# EAGLE schematic LabFriendMain1 (EAGLE 7.7.0), part 2 of 2
## Sheet 12 of 13: Scope Input CH 0
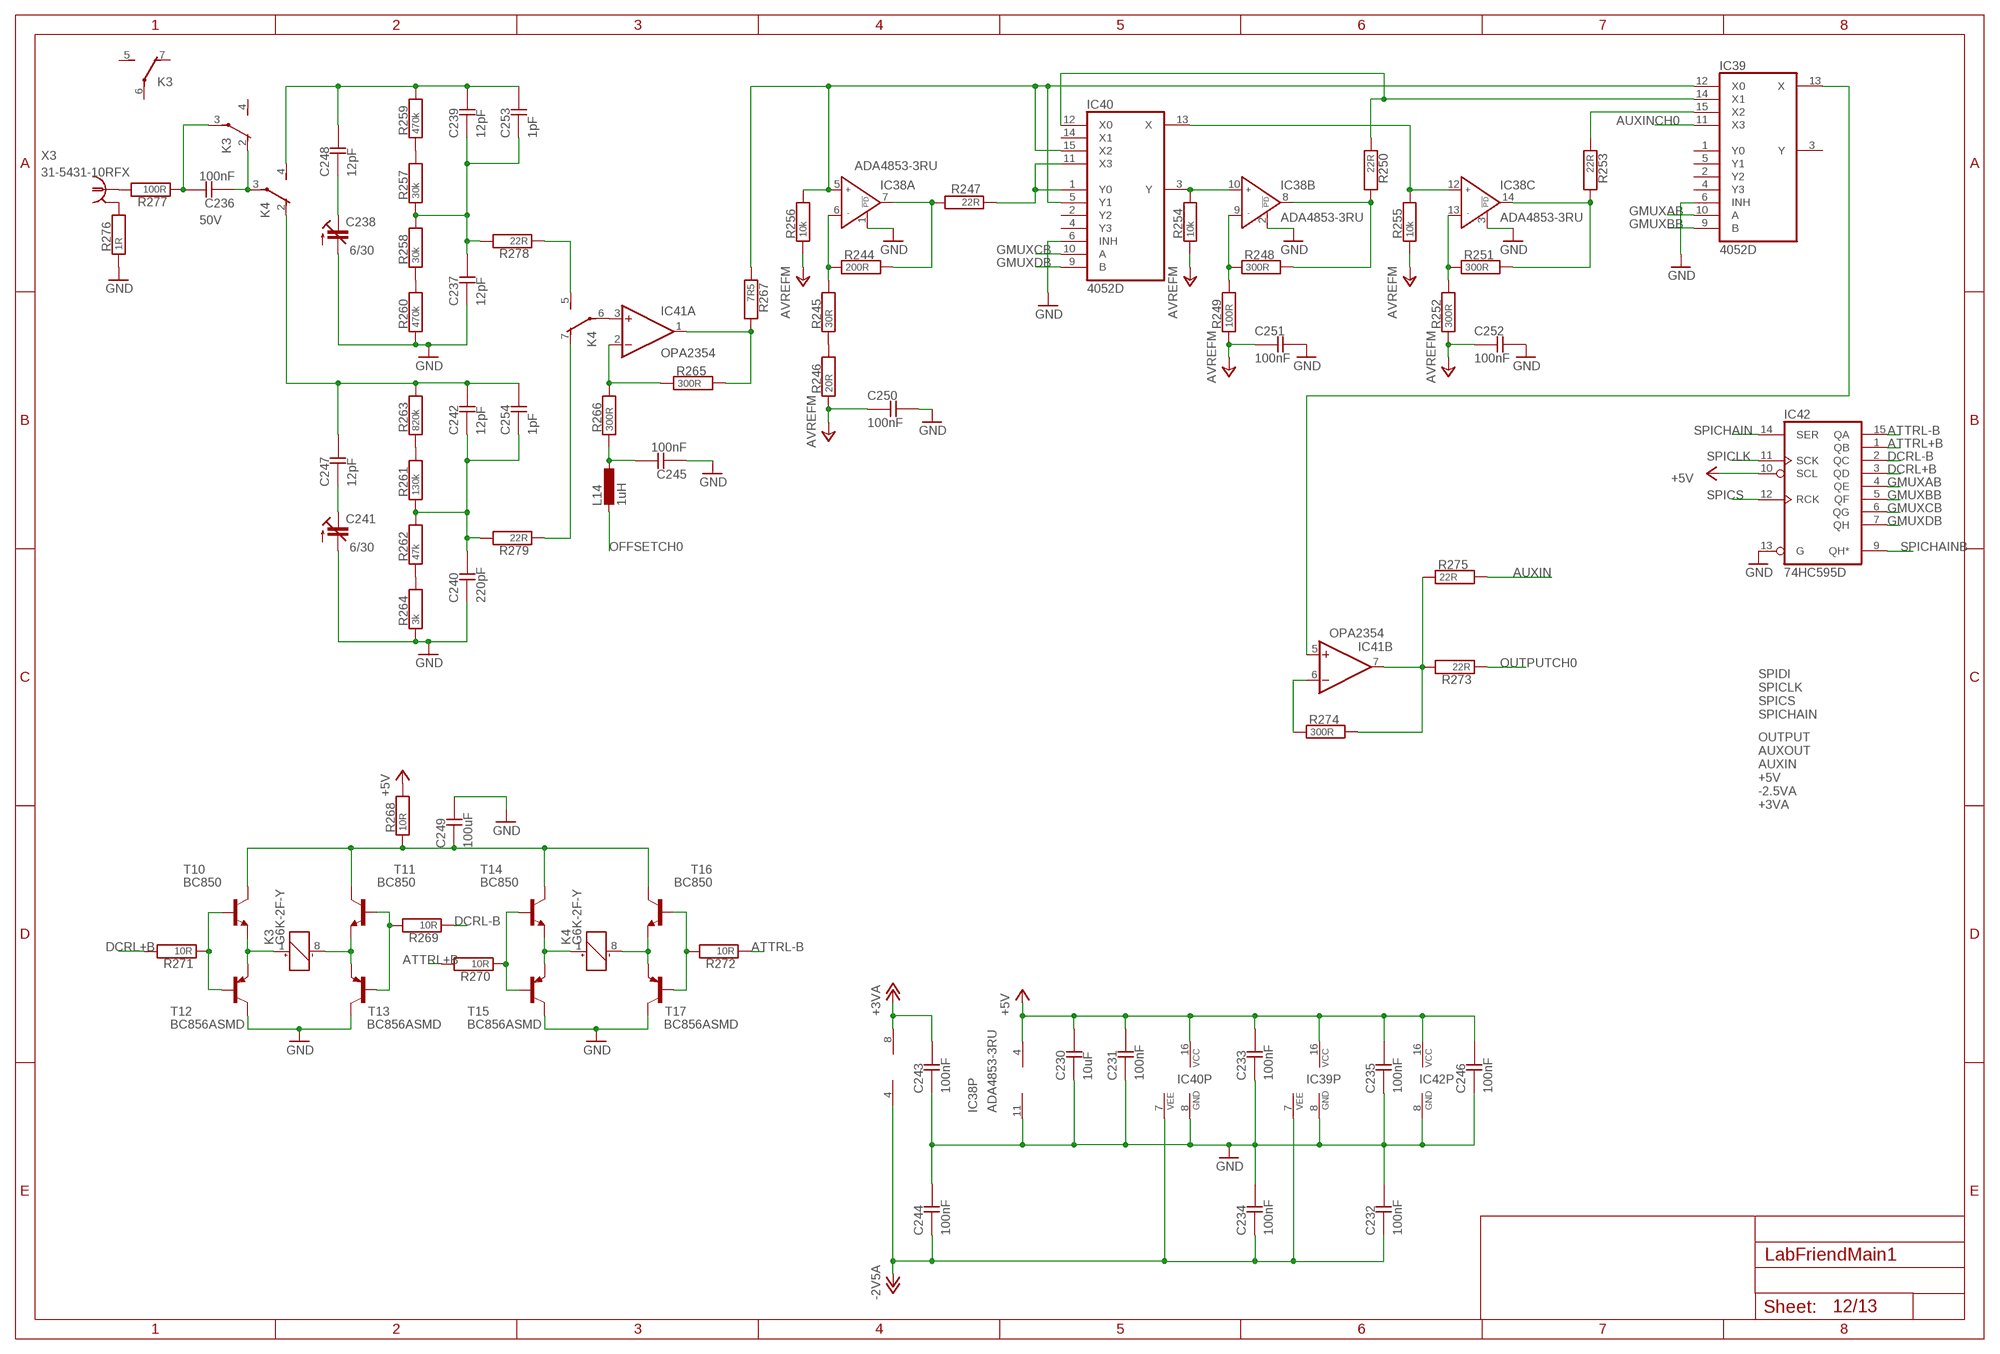
[diagram p11: schematic, sheet 12]

### Parts
C230  10uF  CAPC0603  [0603]
C231  100nF  CAPC0402  [0402]
C232  100nF  CAPC0402  [0402]
C233  100nF  CAPC0402  [0402]
C234  100nF  CAPC0402  [0402]
C235  100nF  CAPC0402  [0402]
C236  100nF  CAPC0603  [0603]
C237  12pF  CAPC0603  [0603]
C238  6/30  C-TRIMMTZBX4  [CTRIMTZBX4]
C239  12pF  CAPC0603  [0603]
C240  220pF  CAPC0603  [0603]
C241  6/30  C-TRIMMTZBX4  [CTRIMTZBX4]
C242  12pF  CAPC0603  [0603]
C243  100nF  CAPC0402  [0402]
C244  100nF  CAPC0402  [0402]
C245  100nF  CAPC0402  [0402]
C246  100nF  CAPC0402  [0402]
C247  12pF  CAPC0603  [0603]
C248  12pF  CAPC0603  [0603]
C249  100uF  CAPC1206  [1206]
C250  100nF  CAPC0402  [0402]
C251  100nF  CAPC0402  [0402]
C252  100nF  CAPC0402  [0402]
C253  1pF  CAPC0603  [0603]
C254  1pF  CAPC0603  [0603]
IC38  ADA4853-3RU  [SO14]
IC39  4052D  [SO16]
IC40  4052D  [SO16]
IC41  OPA2354  AD8682RM  [MSOP08]
IC42  74HC595D  [SO16]
K3  G6K-2F-Y  [G6K-2F-Y]
K4  G6K-2F-Y  [G6K-2F-Y]
L14  1uH  L-EUL3216C  [L3216C]
R244  200R  RESR0603  [0603]
R245  30R  RESR0603  [0603]
R246  20R  RESR0603  [0603]
R247  22R  RESR0603  [0603]
R248  300R  RESR0603  [0603]
R249  100R  RESR0603  [0603]
R250  22R  RESR0603  [0603]
R251  300R  RESR0603  [0603]
R252  300R  RESR0603  [0603]
R253  22R  RESR0603  [0603]
R254  10k  RESR0603  [0603]
R255  10k  RESR0603  [0603]
R256  10k  RESR0603  [0603]
R257  30k  RESR0603  [0603]
R258  30k  RESR0603  [0603]
R259  470k  RESR0603  [0603]
R260  470k  RESR0603  [0603]
R261  130k  RESR0603  [0603]
R262  47k  RESR0603  [0603]
R263  820k  RESR0603  [0603]
R264  3k  RESR0603  [0603]
R265  300R  RESR0603  [0603]
R266  300R  RESR0603  [0603]
R267  7R5  RESR0603  [0603]
R268  10R  RESR0603  [0603]
R269  10R  RESR0603  [0603]
R270  10R  RESR0603  [0603]
R271  10R  RESR0603  [0603]
R272  10R  RESR0603  [0603]
R273  22R  RESR0603  [0603]
R274  300R  RESR0603  [0603]
R275  22R  RESR0603  [0603]
R276  1R  RESR0603  [0603]
R277  100R  RESR0603  [0603]
R278  22R  RESR0603  [0603]
R279  22R  RESR0603  [0603]
T10  BC850  [SOT23]
T11  BC850  [SOT23]
T12  BC856ASMD  [SOT23-BEC]
T13  BC856ASMD  [SOT23-BEC]
T14  BC850  [SOT23]
T15  BC856ASMD  [SOT23-BEC]
T16  BC850  [SOT23]
T17  BC856ASMD  [SOT23-BEC]
X3  31-5431-10RFX  227161-8  [AMP_227161]

### Nets
3V3A: C243.2 IC41.8(P:V+) ; supply symbol labelled +3VA ; also sheet 3,6,7,11
+5V: C230.2 C231.2 C233.2 C235.2 C246.2 IC38.4(P:V+) IC39.16(VCC) IC40.16(VCC) IC42.10(SCL) IC42.16(VCC) R268.2 ; also sheet 6,7,8,9,11,13
-2V5A: C232.1 C234.1 C244.1 IC39.7(VEE) IC40.7(VEE) IC41.4(P:V-) ; also sheet 6,7,11
ATTRL+B: IC42.1(QB) R270.2
ATTRL-B: IC42.15(QA) R272.1
AUXIN: R275.2 ; also sheet 11
AUXINCH0: IC39.11(X3) ; also sheet 9
AVREFM: C250.1 C251.1 C252.1 R246.1 R249.1 R252.1 R254.1 R255.1 R256.1 ; also sheet 7,9,11
DCRL+B: IC42.3(QD) R271.2
DCRL-B: IC42.2(QC) R269.1
GMUXAB: IC39.10(A) IC42.4(QE)
GMUXBB: IC39.9(B) IC42.5(QF)
GMUXCB: IC40.10(A) IC42.6(QG)
GMUXDB: IC40.9(B) IC42.7(QH)
GND: C230.1 C231.1 C232.2 C233.1 C234.2 C235.1 C237.1 C238.2(A) C240.1 C241.2(A) C243.1 C244.2 C245.1 C246.1 C249.2 C250.2 C251.2 C252.2 IC38.1(A:!POWERDOWN) IC38.2(B:!POWERDOWN) IC38.3(C:!POWERDOWN) IC38.11(P:V-) IC39.6(INH) IC39.8(GND) IC40.6(INH) IC40.8(GND) IC42.8(GND) IC42.13(G) R260.1 R264.1 R276.1 T12.C T13.C T15.C T17.C ; also sheet 1,2,3,5,6,7,8,9,10,11,13
N$281: IC38.6(A:IN-) R244.1 R245.2
N$282: IC38.7(A:OUT) R244.2 R247.2
N$283: R245.1 R246.2
N$284: IC38.9(B:IN-) R248.1 R249.2
N$285: IC38.13(C:IN-) R251.1 R252.2
N$286: IC38.14(C:OUT) R251.2 R253.2
N$287: IC38.5(A:IN+) IC39.12(X0) IC40.5(Y1) IC40.15(X2) R256.2 R267.1
N$288: IC38.8(B:OUT) R248.2 R250.2
N$289: IC40.1(Y0) IC40.11(X3) R247.1
N$290: IC38.12(C:IN+) IC40.13(X) R255.2
N$291: IC39.14(X1) IC40.12(X0) R250.1
N$292: IC39.15(X2) R253.1
N$293: IC38.10(B:IN+) IC40.3(Y) R254.2
N$294: C236.2 K3.3(2:P) R277.1
N$295: C236.1 K3.2(2:O) K4.3(2:P)
N$296: R257.2 R259.1
N$297: C237.2 C239.1 C253.1 R257.1 R258.2 R278.2
N$298: R258.1 R260.2
N$299: C239.2 C248.2 C253.2 K4.4(2:S) R259.2
N$300: R261.2 R263.1
N$301: R262.1 R264.2
N$302: C242.2 C247.2 C254.2 K4.2(2:O) R263.2
N$303: IC41.2(A:-IN) R265.1 R266.2
N$304: IC41.1(A:OUT) R265.2 R267.2
N$305: IC39.13(X) IC41.5(B:+IN)
N$306: C249.1 R268.1 T10.3(C) T11.3(C) T14.3(C) T16.3(C)
N$307: K3.8(1:-) T11.2(E) T13.E
N$308: K3.1(1:+) T10.2(E) T12.E
N$309: R271.1 T10.1(B) T12.B
N$310: R269.2 T11.1(B) T13.B
N$311: K4.1(1:+) T14.2(E) T15.E
N$312: K4.8(1:-) T16.2(E) T17.E
N$313: R270.1 T14.1(B) T15.B
N$314: R272.2 T16.1(B) T17.B
N$315: IC41.7(B:OUT) R273.2 R274.2 R275.1
N$316: IC41.3(A:+IN) K4.6(3:P)
N$317: C241.1(E) C247.1
N$318: C238.1(E) C248.1
N$319: IC41.6(B:-IN) R274.1
N$320: C245.2 L14.1 R266.1
N$321: C240.2 C242.1 C254.1 R261.1 R262.2 R279.2
N$322: R276.2 X3.2
N$323: R277.2 X3.1
N$324: K4.5(3:S) R278.1
N$325: K4.7(3:O) R279.1
OFFSETCH0: L14.2 ; also sheet 7
OUTPUTCH0: R273.1 ; also sheet 3
SPICHAIN: IC42.14(SER) ; also sheet 11
SPICHAINB: IC42.9(QH*)
SPICLK: IC42.11(SCK) ; also sheet 1,11
SPICS: IC42.12(RCK) ; also sheet 1,11
Unconnected: IC39.1(Y0) IC39.2(Y2) IC39.3(Y) IC39.4(Y3) IC39.5(Y1) IC40.2(Y2) IC40.4(Y3) IC40.14(X1) K3.4(2:S) K3.5(3:S) K3.6(3:P) K3.7(3:O)

### Notes on the sheet
- SPIDI
  SPICLK
  SPICS
  SPICHAIN
- OUTPUT
  AUXOUT
  AUXIN
  +5V
  -2.5VA
  +3VA

## Sheet 13 of 13: High Frequency DAC
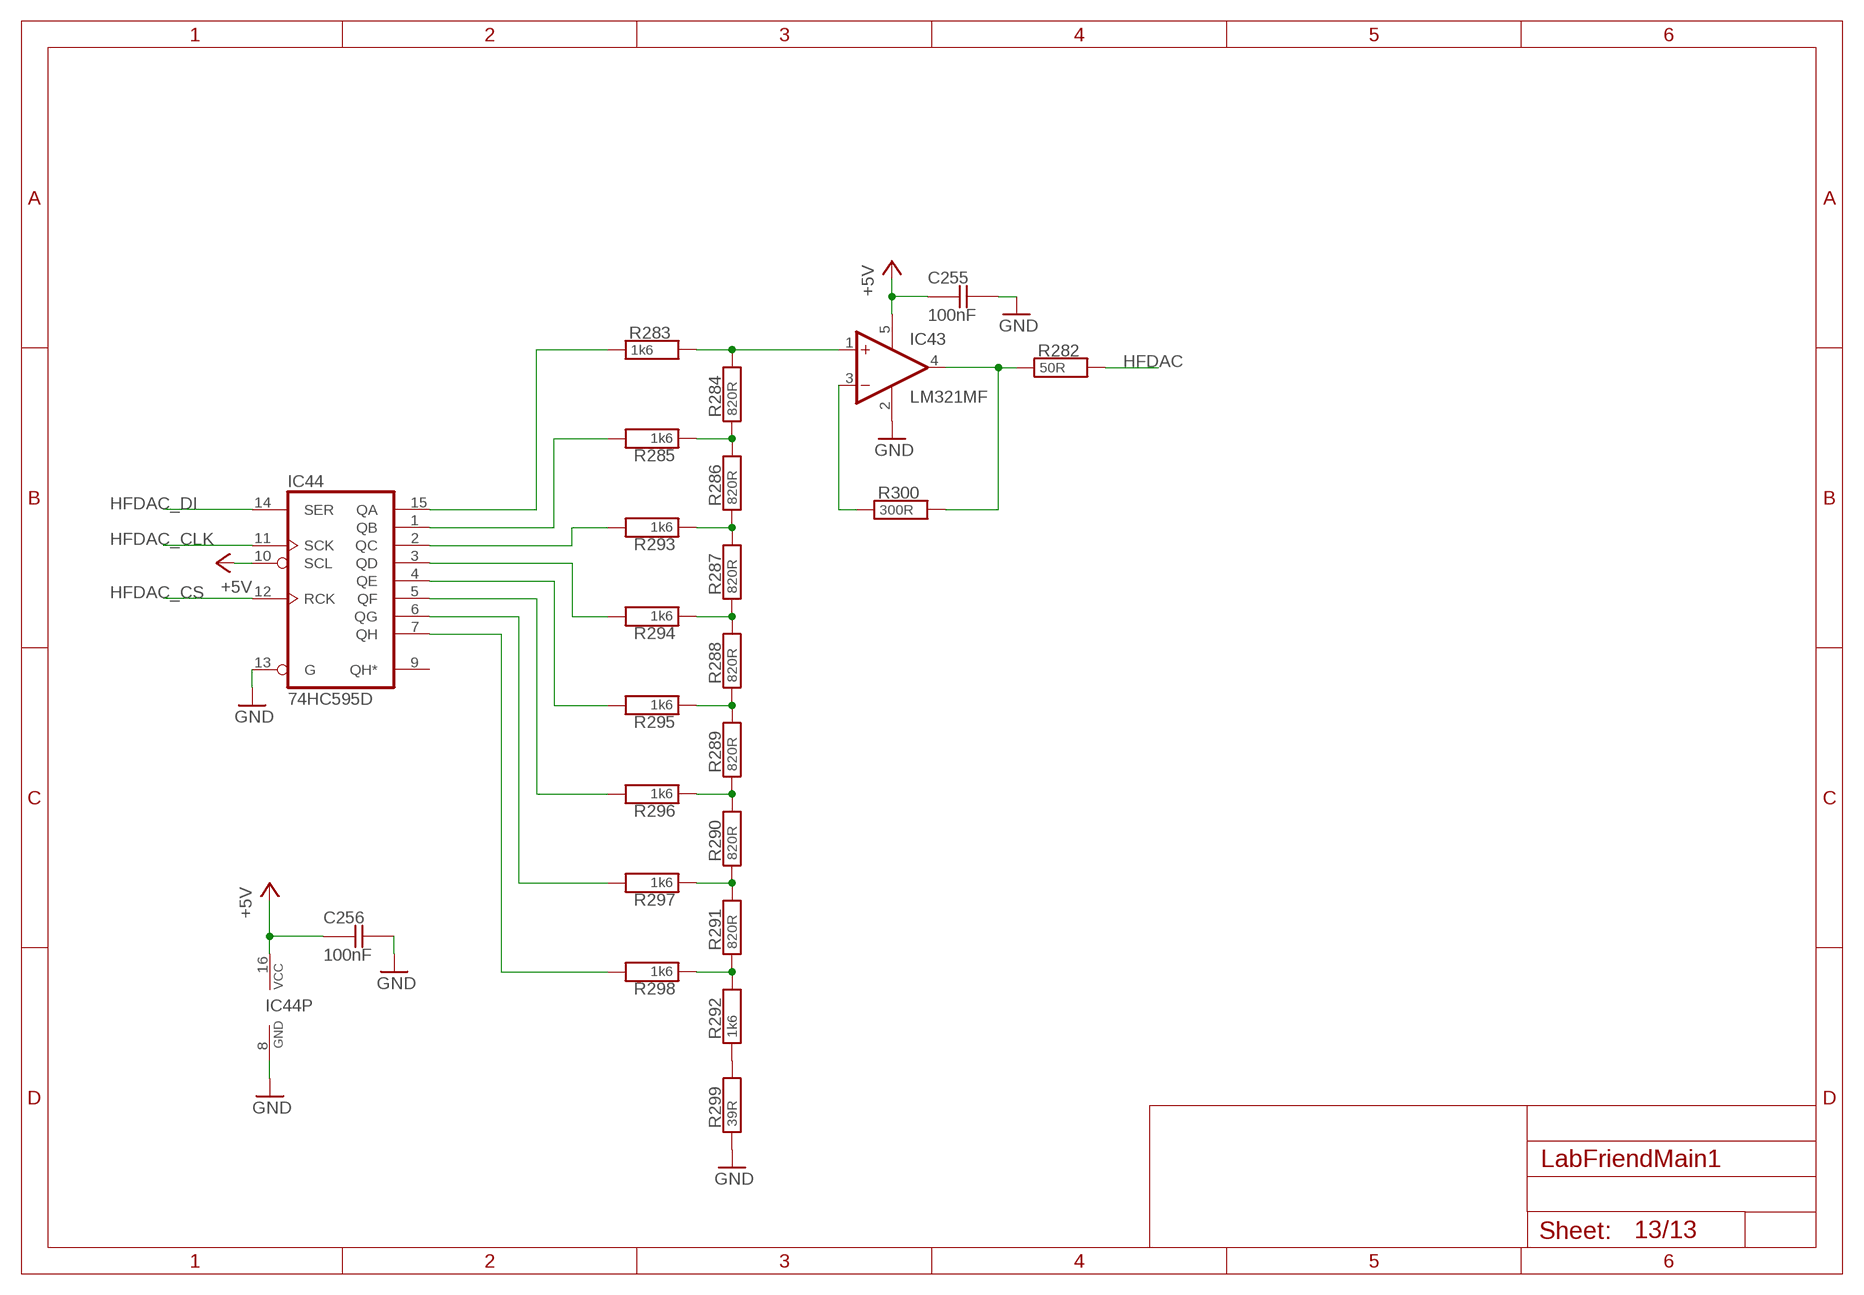
[diagram p12: schematic, sheet 13]

### Parts
C255  100nF  CAPC0402  [0402]
C256  100nF  CAPC0402  [0402]
IC43  LM321MF  [SOT23-5]
IC44  74HC595D  [SO16]
R282  50R  RESR0603  [0603]
R283  1k6  RESR0603  [0603]
R284  820R  RESR0603  [0603]
R285  1k6  RESR0603  [0603]
R286  820R  RESR0603  [0603]
R287  820R  RESR0603  [0603]
R288  820R  RESR0603  [0603]
R289  820R  RESR0603  [0603]
R290  820R  RESR0603  [0603]
R291  820R  RESR0603  [0603]
R292  1k6  RESR0603  [0603]
R293  1k6  RESR0603  [0603]
R294  1k6  RESR0603  [0603]
R295  1k6  RESR0603  [0603]
R296  1k6  RESR0603  [0603]
R297  1k6  RESR0603  [0603]
R298  1k6  RESR0603  [0603]
R299  39R  RESR0603  [0603]
R300  300R  RESR0603  [0603]

### Nets
+5V: C255.1 C256.1 IC43.5(V+) IC44.10(SCL) IC44.16(VCC) ; also sheet 6,7,8,9,11,12
GND: C255.2 C256.2 IC43.2(V-) IC44.8(GND) IC44.13(G) R299.1 ; also sheet 1,2,3,5,6,7,8,9,10,11,12
HFDAC: R282.2 ; also sheet 9
HFDAC_CLK: IC44.11(SCK) ; also sheet 3
HFDAC_CS: IC44.12(RCK) ; also sheet 3
HFDAC_DI: IC44.14(SER) ; also sheet 3
N$333: R284.1 R285.1 R286.2
N$334: R286.1 R287.2 R293.1
N$335: R287.1 R288.2 R294.1
N$336: R288.1 R289.2 R295.1
N$337: R289.1 R290.2 R296.1
N$338: R290.1 R291.2 R297.1
N$339: R291.1 R292.2 R298.1
N$340: R292.1 R299.2
N$341: IC43.1(+IN) R283.2 R284.2
N$342: IC44.15(QA) R283.1
N$343: IC44.1(QB) R285.2
N$344: IC44.2(QC) R293.2
N$345: IC44.3(QD) R294.2
N$346: IC44.4(QE) R295.2
N$347: IC44.5(QF) R296.2
N$348: IC44.6(QG) R297.2
N$349: IC44.7(QH) R298.2
N$350: IC43.3(-IN) R300.1
N$351: IC43.4(OUT) R282.1 R300.2
Unconnected: IC44.9(QH*)

## Library data of the parts
C1-C97 C104-C112 C115-C120 C125 C126 C134 C137-C156 C160 C162-C210 C212 C214 C215 C217-C235 C237 C239 C240 C242-C256 = passive:CAP
C98-C102 C114 C121-C124 C127 C128 = passive:CAP; TYPE: NP0/C0G
C103 C113 C129-C133 C135 C136 = passive:CAP; VOLTAGE: 10V
C157-C159 C161 = rcl:CPOL-EU: POLARIZED CAPACITOR, European symbol
C211 C236 = passive:CAP; VOLTAGE: 50V
C213 C216 C238 C241 = rcl:C-TRIMM: Trimm capacitor
D1-D6 = diode:DIODE-: DIODE
IC1 IC10 = seabed:TPS62560: 600mA Step Down Regulator; DATASHEET: http://focus.ti.com/docs/prod/folders/print/tps62560.html; SOURCE: Digikey: 296-23105-1-ND; TYPE: TPS62560DRVT
IC2 = microchip:25*: Serial EEPROM 4K/ 8K , SPI bus; MF: MICROCHIP; MPN: 25AA080/SN; OC_FARNELL: 1816072; OC_NEWARK: 92C7351
IC3 = teg4:SI8462
IC4 = teg4:FT232H
IC5 IC6 = teg4:ADC08200
IC7 IC11 IC12 IC29 = seabed:TPS73001: Low Noise LDO; DATASHEET: http://focus.ti.com/docs/prod/folders/print/tps73001.html; SOURCE: Farnell: 1135389; TYPE: TPS73001DBVT
IC8 = microchip:93*: Serial EPROM 1 K/2 K/4 K, low voltage, Microwire; MF: MICROCHIP; MPN: 93LC56T/SN; OC_FARNELL: 9758240; OC_NEWARK: 92C7699
IC9 = teg4:74LVC8T245
IC13 = data-converters:AK4621: AK4621 24-Bit 192kHz Ste reo Audio CODEC, 100dB THD+N; DIGIKEY: 974-1041-2-ND; MANFPART: AK4621EF; PRICE: 29
IC14 IC28 = seabed:TPS72301: Low Noise Negative LDO; DATASHEET: http://focus.ti.com/docs/prod/folders/print/tps72301.html; SOURCE: Farnell: 1207336; TYPE: TPS72301DBVT
IC15-IC17 IC21 IC23 = linear:LM358: OP AMP also LM158; LM258; LM2904 Source: http://cache.national.com/ds/LM/LM158.pdf
IC18 IC19 IC30 IC31 = linear:LMV358?*: Dual General Purpose, Low Voltage, Rail-to-Rail Output Operational Amplifiers Source: http://www.national.com/mpf/LM/LMV321.html http://www.national.com/dt/lmv_qual.pdf
IC20 = switch_mux:ISL54405
IC22 IC34 IC35 IC39 IC40 = 40xx:4052: Dual 4-channel ANALOG MULTIPLEXER
IC24 = 74xx-eu:74*00: Quad 2-input NAND gate
IC25 = amplifiers-and-linear:INA331
IC26 = teg4:MT41J128M8: MT41J128M8_Pinout edit this description Auto generated by make-symbol-device-package-bsdl.ulp Rev. 39 Source: MT41J128M8_Pinout.txt
IC27 = 74xx-eu:74*132: Quad 2-input NAND schmitt trigger
IC32 = data-converters:ADS1118: Low Power 4 channel 16 bit ADC 860sps
IC33 IC38 = teg4:ADA4853-3RU: Low Power, Rail-to-Rail Output, Video Op Amps with Ultralow Power Source: http://www.analog.com/static/imported-files/data_sheets/ADA4853-1_4853-2_4853-3.pdf
IC36 IC41 = linear:AD8682: Dual Low Power, High Speed JFET Operational Amplifiers Source: http://www.analog.com/UploadedFiles/Data_Sheets/AD8682_8684.pdf
IC37 IC42 IC44 = 74xx-eu:74*595: 8-bit SHIFT REGISTER, output latch
IC43 = linear:LM321?*: Low Power Single Op Amp Source: http://cache.national.com/ds/LM/LM321.pdf
K1-K4 = relay:G6K: Low Signal Relay oeiwcsnts1.omron.com/.. D20G6K0100.pdf; MF: OMRON COMPONENTS USA; MPN: G6K-2F-Y DC3; OC_FARNELL: 1690316; OC_NEWARK: 89C6451
L1-L3 L6 L12 L14 = rcl:L-EU: INDUCTOR, European symbol
L4 L5 L8-L11 = passive:INUDCTOR
L7 L13 = rcl:L-US: INDUCTOR, American symbol
Q1 = crystal:CRYSTAL: CRYSTAL; OC_FARNELL: unknown; OC_NEWARK: unknown
Q2 Q3 = transistor-small-signal:BSS123: N-CHANNEL MOS FET
QG1 = crystal:SM77H: 3.3V CMOS Clock Oscillator Source: www.pletronics.com .. sm77h%203.3v.pdf; OC_FARNELL: unknown; OC_NEWARK: unknown
R1-R300 = passive:RES
SV1 = con-ml:ML10: HARTING; OC_FARNELL: unknown; OC_NEWARK: unknown
SV2-SV4 = con-lstb:MA08-2W: PIN HEADER; OC_FARNELL: unknown; OC_NEWARK: unknown
SV5 = con-lstb:MA03-1: PIN HEADER; OC_FARNELL: unknown; OC_NEWARK: unknown
T1 = transformers:EFD15DCDCPM5P33
T2-T4 T8 T10 T11 T14 T16 = transistor:BC850: NPN TRANSISTOR
T5-T7 T9 T12 T13 T15 T17 = transistor-pnp:BC856*: PNP Transistror
U2 = xilinx_devices:6SLX9FTG256: Xilinx FPGA: 6SLX9FTG256
X1 = con-cypressindustries:MINI-USB-: MINI USB-B Conector Source: www.cypressindustries.com; OC_FARNELL: unknown; OC_NEWARK: unknown
X2 X3 = connectors:?227161*: JACK, RIGHT ANGLE, 50 OHM, PCB, BNC Source: ENG_CD_5227161_B1.pdf; ALTERNATIVE: LowCost(DX, ebay...); ALTPRICE: 5.6; DIGIKEY: A32260-ND; PRICE: 16